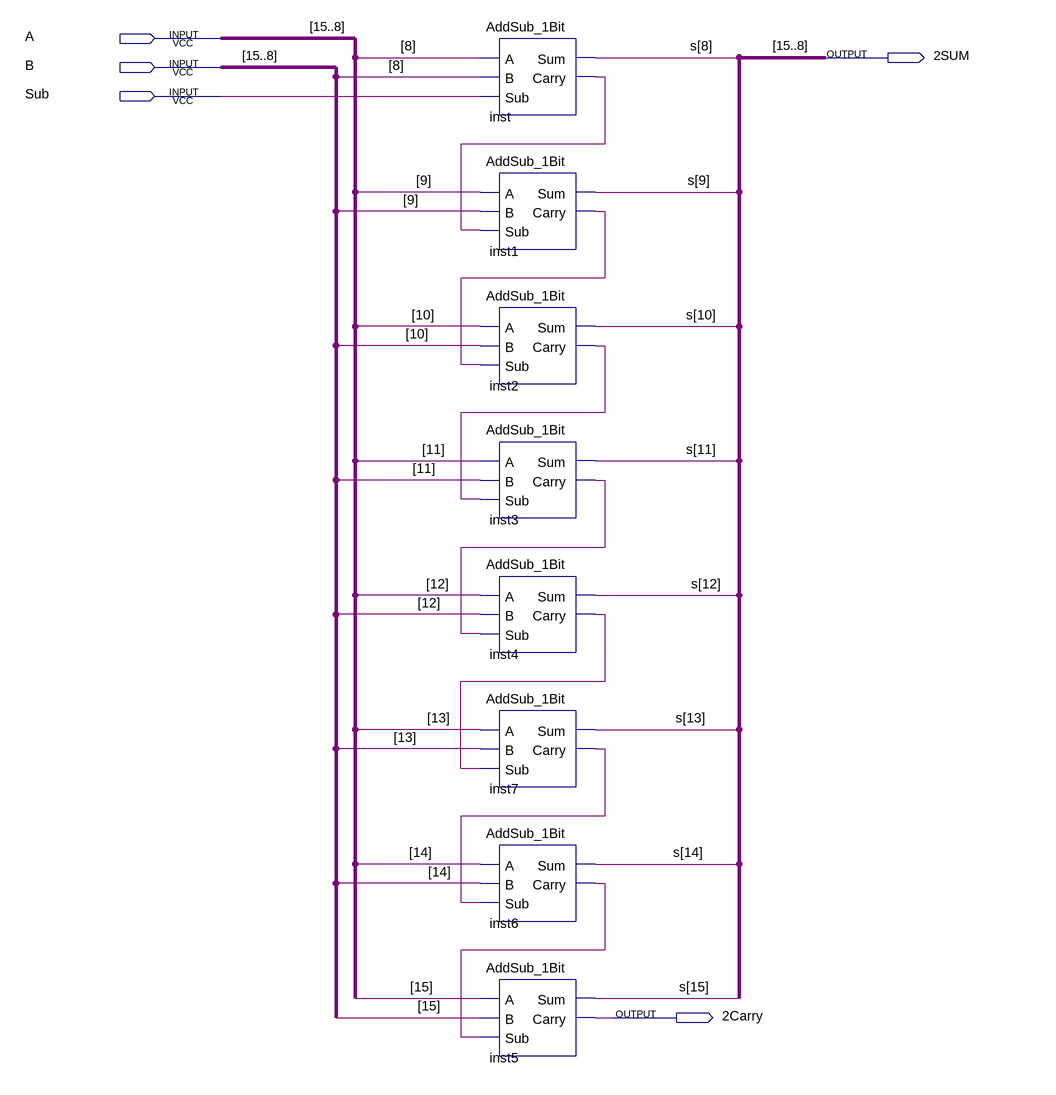
[diagram p0: schematic sheet]
// Quartus schematic Second8Bit_AddSub.bdf as structural Verilog: 8 symbols, 5 pins
module Second8Bit_AddSub (
  input  A,
  input  B,
  input  Sub,
  output \2SUM ,
  output \2Carry 
);

  wire inst1_carry, inst2_carry, inst3_carry, inst4_carry, inst6_carry, inst7_carry, inst_carry;
  wire [15:8] s;

  AddSub_1Bit inst (.A(A), .B(B), .Sub(Sub), .Sum(s[8]), .Carry(inst_carry));
  AddSub_1Bit inst1 (.A(A), .B(B), .Sub(inst_carry), .Sum(s[9]), .Carry(inst1_carry));
  AddSub_1Bit inst2 (.A(A), .B(B), .Sub(inst1_carry), .Sum(s[10]), .Carry(inst2_carry));
  AddSub_1Bit inst3 (.A(A), .B(B), .Sub(inst2_carry), .Sum(s[11]), .Carry(inst3_carry));
  AddSub_1Bit inst4 (.A(A), .B(B), .Sub(inst3_carry), .Sum(s[12]), .Carry(inst4_carry));
  AddSub_1Bit inst7 (.A(A), .B(B), .Sub(inst4_carry), .Sum(s[13]), .Carry(inst7_carry));
  AddSub_1Bit inst6 (.A(A), .B(B), .Sub(inst7_carry), .Sum(s[14]), .Carry(inst6_carry));
  AddSub_1Bit inst5 (.A(A), .B(B), .Sub(inst6_carry), .Sum(s[15]), .Carry(\2Carry ));
endmodule
